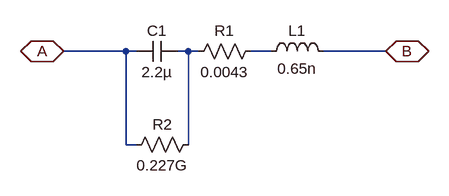
[diagram p0: schematic FlyingCap.asc]
FlyingCap.asc, the LTspice schematic file:
Version 4.1
SHEET 1 880 680
WIRE 112 128 16 128
WIRE 128 128 112 128
WIRE 208 128 192 128
WIRE 224 128 208 128
WIRE 336 128 304 128
WIRE 512 128 416 128
WIRE 112 272 112 128
WIRE 128 272 112 272
WIRE 208 272 208 128
FLAG 16 128 A
IOPIN 16 128 BiDir
FLAG 512 128 B
IOPIN 512 128 BiDir
SYMBOL cap 192 112 R90
WINDOW 0 0 32 VBottom 2
WINDOW 3 32 32 VTop 2
SYMATTR InstName C1
SYMATTR Value 2.2µ
SYMBOL res 320 112 R90
WINDOW 0 0 56 VBottom 2
WINDOW 3 32 56 VTop 2
SYMATTR InstName R1
SYMATTR Value 0.0043
SYMBOL res 112 288 R270
WINDOW 0 32 56 VTop 2
WINDOW 3 0 56 VBottom 2
SYMATTR InstName R2
SYMATTR Value 0.227G
SYMBOL ind 320 144 R270
WINDOW 0 32 56 VTop 2
WINDOW 3 5 56 VBottom 2
SYMATTR InstName L1
SYMATTR Value 0.65n
SYMATTR SpiceLine Rser=1m

The netlist it stands for:
* FlyingCap.asc
C1 N001 A 2.2µ
R1 N002 N001 0.0043
R2 A N001 0.227G
L1 N002 B 0.65n Rser=1m
.backanno
.end